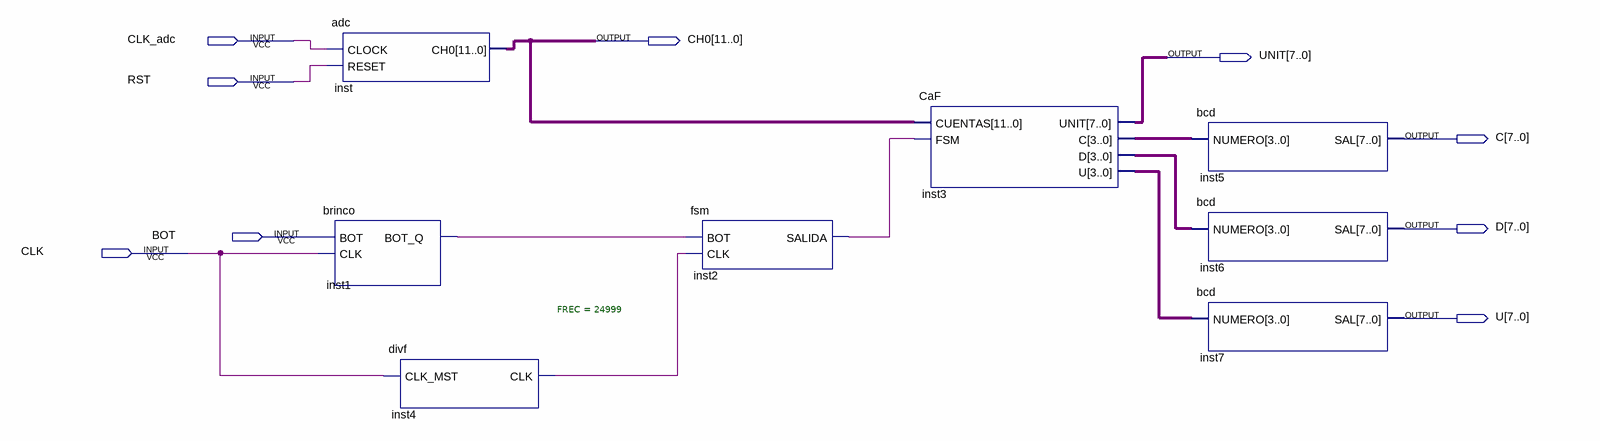
[diagram p0: schematic sheet]
// Quartus schematic Block1.bdf as structural Verilog: 8 symbols, 9 pins
module Block1 (
  input  CLK_adc,
  input  RST,
  input  BOT,
  input  CLK,
  output [11:0] CH0,
  output [7:0] UNIT,
  output [7:0] C,
  output [7:0] D,
  output [7:0] U
);

  wire inst1_bot_q, inst2_salida, inst4_clk;
  wire [3:0] inst3_c, inst3_d, inst3_u;

  adc inst (.CLOCK(CLK_adc), .RESET(RST), .CH0(CH0));
  brinco inst1 (.BOT(BOT), .CLK(CLK), .BOT_Q(inst1_bot_q));
  divf #(.FREC(24999)) inst4 (.CLK_MST(CLK), .CLK(inst4_clk));
  fsm inst2 (.BOT(inst1_bot_q), .CLK(inst4_clk), .SALIDA(inst2_salida));
  CaF inst3 (.CUENTAS(CH0), .FSM(inst2_salida), .UNIT(UNIT), .C(inst3_c), .D(inst3_d), .U(inst3_u));
  bcd inst5 (.NUMERO(inst3_c), .SAL(C));
  bcd inst6 (.NUMERO(inst3_d), .SAL(D));
  bcd inst7 (.NUMERO(inst3_u), .SAL(U));
endmodule
